# Altium schematic sheet TOP.SchDoc: Sensor Array Test
size A4; DrawnBy: Brandon Skarka; Revision: 0; SheetNumber: 1; SheetTotal: 2
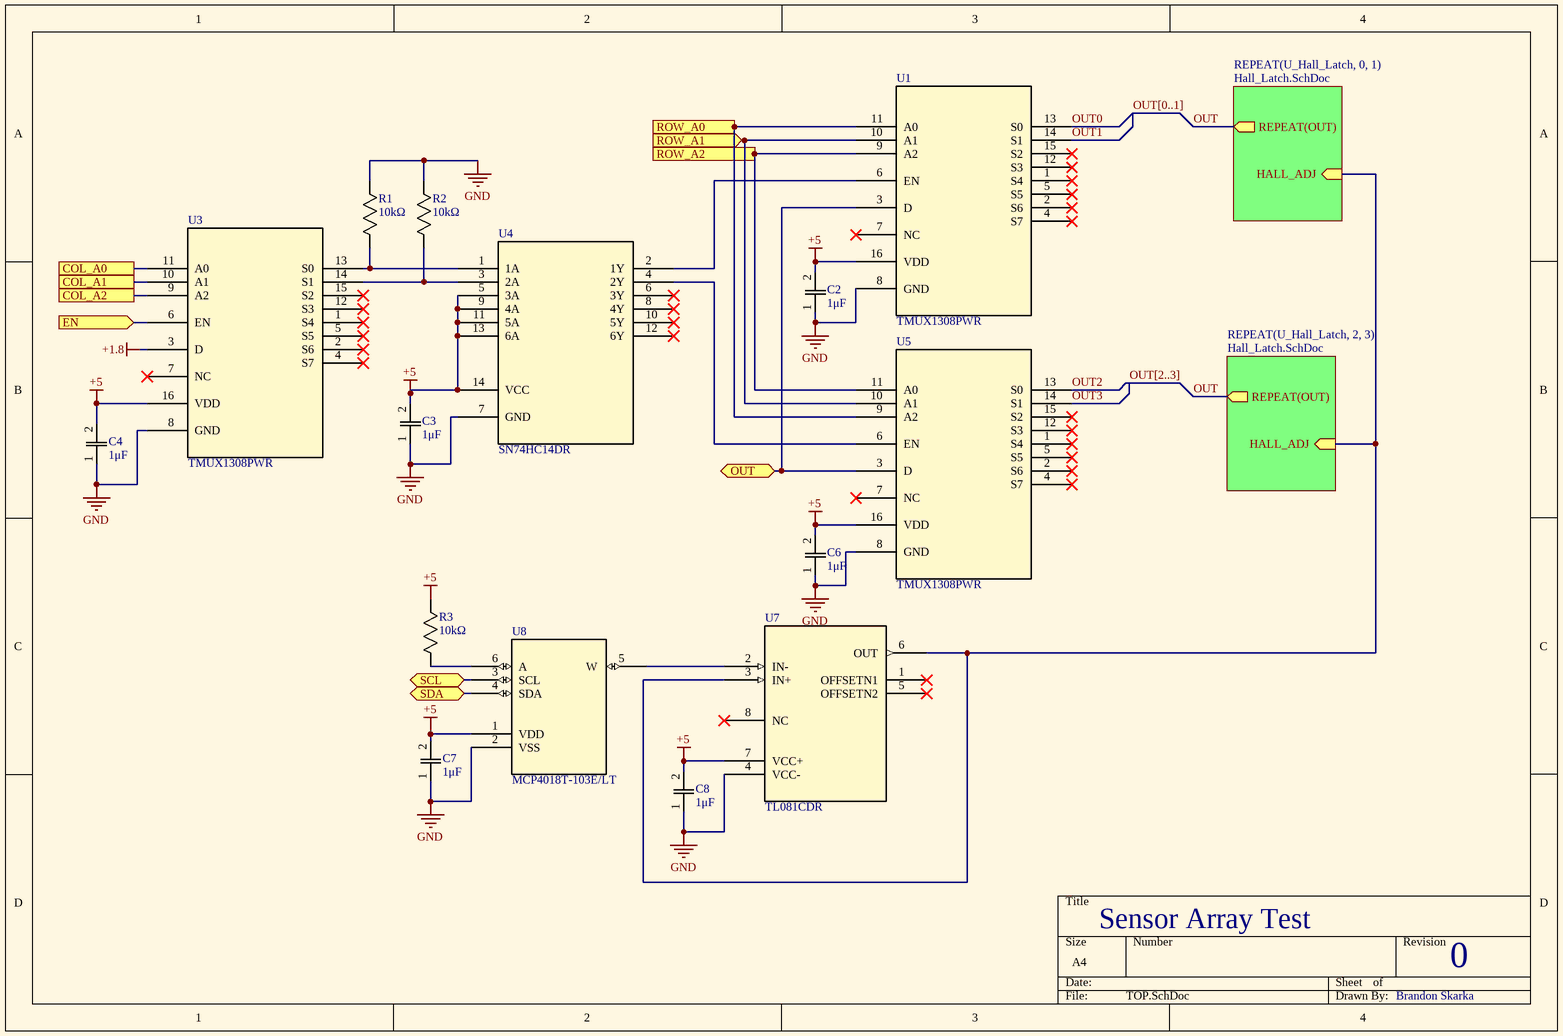
[diagram p0: TOP.SchDoc]

## Parts
C2  1μF  [CAP_CL10_SAM]
C3  1μF  [CAP_CL10_SAM]
C4  1μF  [CAP_CL10_SAM]
C6  1μF  [CAP_CL10_SAM]
C7  1μF  [CAP_CL10_SAM]
C8  1μF  [CAP_CL10_SAM]
R1  10kΩ  [RES_RC0603_YAG]
R2  10kΩ  [RES_RC0603_YAG]
R3  10kΩ  [RES_RC0603_YAG]
U1  TMUX1308PWR  [TSSOP16_PW_TEX]
U3  TMUX1308PWR  [TSSOP16_PW_TEX]
U4  SN74HC14DR  [D14]
U5  TMUX1308PWR  [TSSOP16_PW_TEX]
U7  TL081CDR  [D8]
U8  MCP4018T-103E/LT  [SC70-6_MC_MCH]

## Sub-sheets
REPEAT(U_Hall_Latch, 0, 1) = Hall_Latch.SchDoc: REPEAT(OUT) (out), HALL_ADJ (in)
REPEAT(U_Hall_Latch, 2, 3) = Hall_Latch.SchDoc: REPEAT(OUT) (out), HALL_ADJ (in)

## Ports
COL_A0, COL_A1, COL_A2, EN (in), OUT (bidir), ROW_A0 (in), ROW_A1 (in), ROW_A2 (in), SCL (bidir), SDA (bidir)

## Nets
+1.8: U3.3(D)
+5: C2.2 C3.2 C4.2 C6.2 C7.2 C8.2 R3.2 U1.16(VDD) U3.16(VDD) U4.5(3A) U4.9(4A) U4.11(5A) U4.13(6A) U4.14(VCC) U5.16(VDD) U7.7(VCC+) U8.1(VDD)
GND: C2.1 C3.1 C4.1 C6.1 C7.1 C8.1 R1.2 R2.2 U1.8(GND) U3.8(GND) U4.7(GND) U5.8(GND) U7.4(VCC-) U8.2(VSS)
COL_A0: U3.11(A0) ; port COL_A0
COL_A1: U3.10(A1) ; port COL_A1
COL_A2: U3.9(A2) ; port COL_A2
EN: U3.6(EN) ; port EN
OUT: U1.3(D) U5.3(D) ; port OUT
OUT: sheet REPEAT(U_Hall_Latch, 0, 1)/REPEAT(OUT), sheet REPEAT(U_Hall_Latch, 2, 3)/REPEAT(OUT)  [a separate net that carries the same name]
OUT0: U1.13(S0)
OUT1: U1.14(S1)
OUT2: U5.13(S0)  [also labelled OUT[2..3]]
OUT3: U5.14(S1)
ROW_A0: U1.11(A0) U5.9(A2) ; port ROW_A0
ROW_A1: U1.10(A1) U5.10(A1) ; port ROW_A1
ROW_A2: U1.9(A2) U5.11(A0) ; port ROW_A2
SCL: U8.3(SCL) ; port SCL
SDA: U8.4(SDA) ; port SDA
NetR1_1: R1.1 U3.13(S0) U4.1(1A)
NetR2_1: R2.1 U3.14(S1) U4.3(2A)
NetR3_1: R3.1 U8.6(A)
NetU1_6: U1.6(EN) U4.2(1Y)
NetU4_4: U4.4(2Y) U5.6(EN)
NetU7_2: U7.2(IN-) U8.5(W)
NetU7_3: U7.3(IN+) U7.6(OUT) ; sheet REPEAT(U_Hall_Latch, 0, 1)/HALL_ADJ, sheet REPEAT(U_Hall_Latch, 2, 3)/HALL_ADJ

Not connected (* = marked no-connect by the designer): U1 1(S4)* 2(S6)* 4(S7)* 5(S5)* 7(NC)* 12(S3)* 15(S2)*; U3 1(S4)* 2(S6)* 4(S7)* 5(S5)* 7(NC)* 12(S3)* 15(S2)*; U4 6(3Y)* 8(4Y)* 10(5Y)* 12(6Y)*; U5 1(S4)* 2(S6)* 4(S7)* 5(S5)* 7(NC)* 12(S3)* 15(S2)*; U7 1(OFFSETN1)* 5(OFFSETN2)* 8(NC)*

## Buses and harness runs
bus OUT[0..1]

## Library data of the parts
C2-C4 C6-C8 = CL10B104KB8NNWC: No Description Available; Mfr_Name: Samsung; Digi-Key_Part_Number_3: 1276-1935-6-ND; Digi-Key_Part_Number_2: 1276-1935-1-ND; Digi-Key_Part_Number_1: 1276-1935-2-ND; Supplier 1: Digi-Key; Supplier Part Number 1: 1276-1935-6-ND; Supplier 2: Mouser; Supplier Part Number 2: 187-CL10B104KB8NNWC
R1-R3 = RC0603FR-7W10KL: No Description Available; Mfr_Name: Yageo; Copyright: Copyright (C) 2023 Ultra Librarian. All rights reserved.; Manufacturer_Part_Number: RC0603FR-7W10KL; RefDes: RefDes; Type: DEV; Supplier 1: Mouser; Supplier Part Number 1: 603-RC0603FR-7W10KL; Supplier 2: Digi-Key; Supplier Part Number 2: 13-RC0603FR-7W10KLCT-ND
U1 U3 U5 = TMUX1308PWR: No Description Available; Mfr_Name: Texas Instruments; RefDes: RefDes; Type: Type; Supplier 1: Mouser; Supplier Part Number 1: 595-TMUX1308PWR; Supplier 2: Digi-Key; Supplier Part Number 2: 296-TMUX1308PWRCT-ND
U4 = SN74HC14DR: No Description Available; Mfr_Name: Texas Instruments; Digi-Key_Part_Number_4: 2156-SN74HC14DR-ND; Digi-Key_Part_Number_3: 296-1194-6-ND; Digi-Key_Part_Number_1: 296-1194-1-ND; Digi-Key_Part_Number_2: 296-1194-2-ND; RefDes: RefDes; Type: Type; Supplier 1: Mouser; Supplier Part Number 1: 595-SN74HC14DR; Supplier 2: Digi-Key; Supplier Part Number 2: 296-1194-1-ND
U7 = TL081CDR: No Description Available; Mfr_Name: Texas Instruments; Copyright: Copyright (C) 2023 Ultra Librarian. All rights reserved.; Manufacturer_Part_Number: TL081CDR; RefDes: RefDes; Type: DEV; Supplier 1: Mouser; Supplier Part Number 1: 595-TL081CDR; Supplier 2: Digi-Key; Supplier Part Number 2: 296-15001-1-ND
U8 = MCP4018T-103ELT: No Description Available; Mfr_Name: Microchip; Copyright: Copyright (C) 2023 Ultra Librarian. All rights reserved.; Manufacturer_Part_Number: MCP4018T-103E/LT; RefDes: RefDes; Type: DEV; Supplier 1: Mouser; Supplier Part Number 1: 579-MCP4018T103E/LT; Supplier 2: Digi-Key; Supplier Part Number 2: MCP4018T-103E/LTCT-ND